# Altium schematic sheet Power.SchDoc
size A4; SheetNumber: 5; SheetTotal: 7
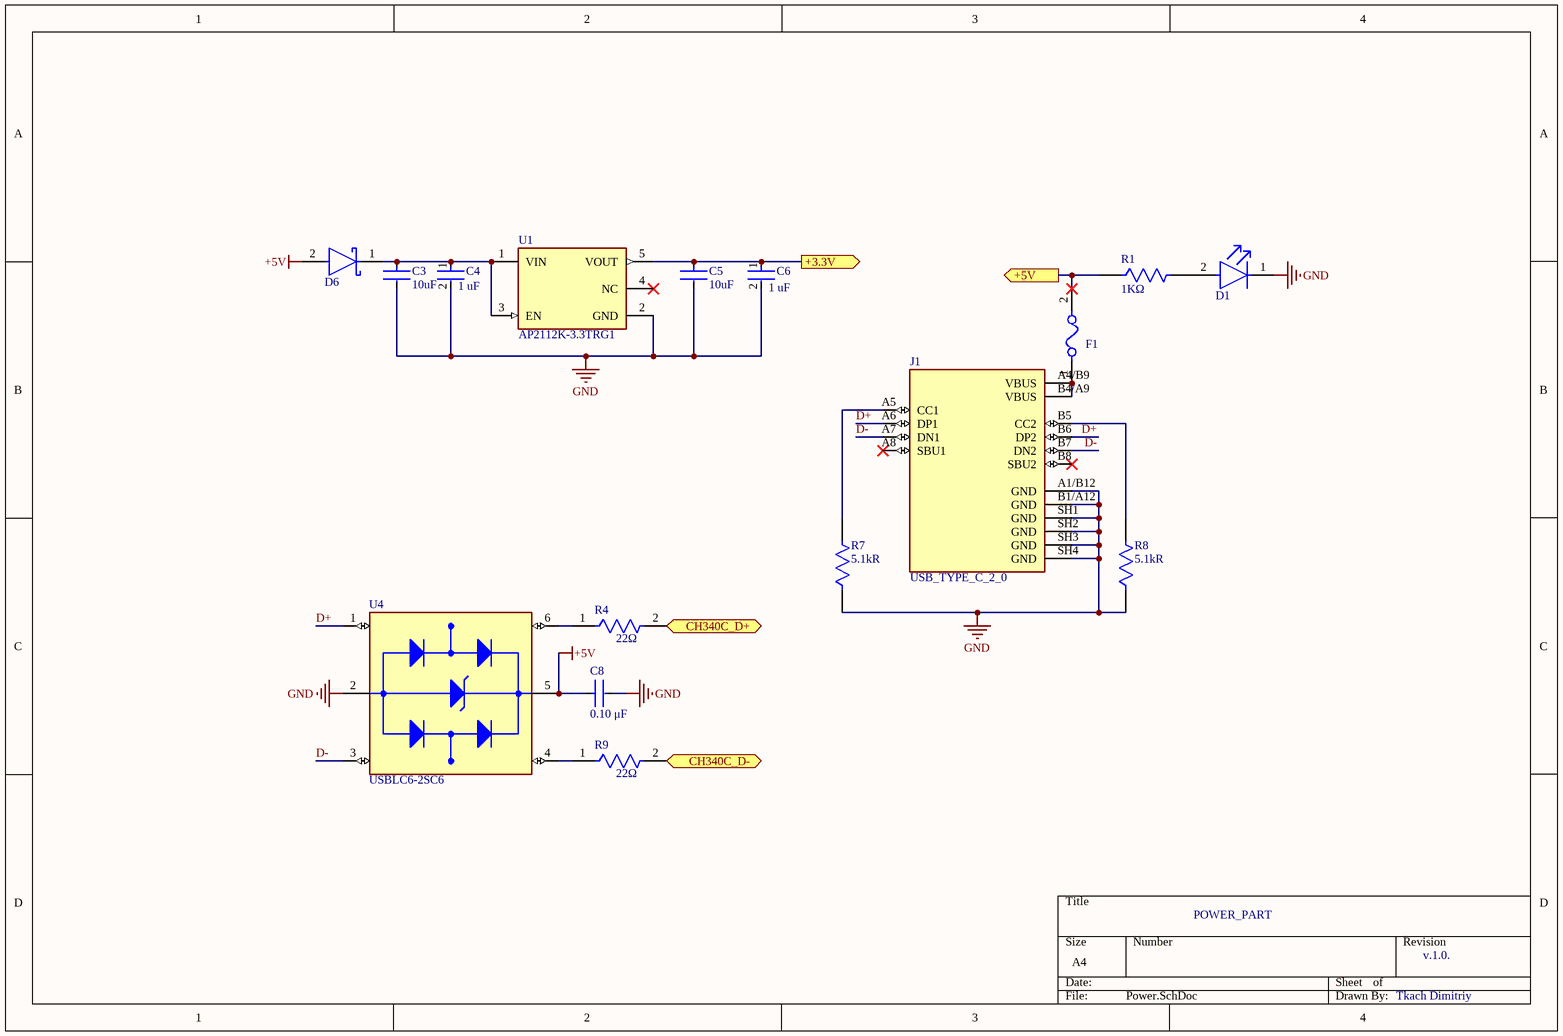
[diagram p0: Power.SchDoc]

## Parts
C3  Capacity: 10uF  [CAPC3216X18M]  (hidden comment: CGA5L1X7R1C106KT0Y0N)
C4  value 1 uF  [CAPC3216X18M]  (hidden comment: CC1206KFX7R7BB105)
C5  Capacity: 10uF  [CAPC3216X18M]  (hidden comment: CGA5L1X7R1C106KT0Y0N)
C6  value 1 uF  [CAPC3216X18M]  (hidden comment: CC1206KFX7R7BB105)
C8  Capacitance: 0.10 μF  [CAPC3216X18M]  (hidden comment: C1206C104K5RACAUTO)
D1  LTST-C150KRKT  [FP-LTST-C150KRKT-MFG]  (value not drawn)
D6  1N5819HW-7-F  [FP-SOD123-MFG]  (value not drawn)
F1  MF-NSMF050-2  [RESC3216X06M]  (value not drawn)
J1  USB_TYPE_C_2_0  [USB Type-C 16Pin]
R1  value 1KΩ  [RESC3216X06M]  (hidden comment: CRGCQ1206F1K0)
R4  Resistance: 22Ω  [RESC3216X06M]  (hidden comment: SR0603FR-7T22RL)
R7  Resistance: 5.1kR  [RESC3216X06M]  (hidden comment: ESR18EZPF5101)
R8  Resistance: 5.1kR  [RESC3216X06M]  (hidden comment: ESR18EZPF5101)
R9  Resistance: 22Ω  [RESC3216X06M]  (hidden comment: SR0603FR-7T22RL)
U1  AP2112K-3.3TRG1  [FP-SOT25-IPC_A]
U4  USBLC6-2SC6  [SOT95P280X145-6N]

## Ports
+3.3V (out, see MainSheet[2B], NTC[3B], STM8S103F3P6[3B], TM1637_Display[1B], UART[2B]), +5V (out, see MainSheet[2B], Relay[2B], TM1637_Display[3B], UART[3B]), CH340C_D+ (bidir, see MainSheet[1B], UART[3B]), CH340C_D- (bidir, see MainSheet[1B], UART[3B])

## Nets
+5V: C8.1 D6.2(A) U4.5(VBUS)
GND: C3.2 C4.2 C5.2 C6.2 C8.2 D1.1(C) J1.A1/B12(GND) J1.B1/A12(GND) J1.SH1(GND) J1.SH2(GND) J1.SH3(GND) J1.SH4(GND) R7.1 R8.1 U1.2(GND) U4.2(GND)
+3.3V: C5.1 C6.1 U1.5(VOUT) ; port +3.3V
+5V: F1.2 R1.1 ; port +5V  [a separate net that carries the same name]
CH340C_D+: R4.2 ; port CH340C_D+
CH340C_D-: R9.2 ; port CH340C_D-
D+: J1.A6(DP1) J1.B6(DP2) U4.1(I/O1_IN)
D-: J1.A7(DN1) J1.B7(DN2) U4.3(I/O2_IN)
NetC3_1: C3.1 C4.1 D6.1(C) U1.1(VIN) U1.3(EN)
NetD1_2: D1.2(A) R1.2
NetF1_1: F1.1 J1.A4/B9(VBUS) J1.B4/A9(VBUS)
NetJ1_A5: J1.A5(CC1) R7.2
NetJ1_B5: J1.B5(CC2) R8.2
NetR4_1: R4.1 U4.6(I/O1_OUT)
NetR9_1: R9.1 U4.4(I/O2_OUT)

Not connected (* = marked no-connect by the designer): J1 A8(SBU1)* B8(SBU2)*; U1 4(NC)*

## Notes on the sheet
- POWER_PART
- v.1.0.
- Tkach Dimitriy

## Library data of the parts
C3 C5 = CMP-08246-001386-1: Cap Ceramic 10uF 16V X7R 10% Pad SMD 1206 +125°C Automotive T/R
C4 C6 = CMP-03422-001151-1: CC1206 1 uF X7R 10.00%16 V; Manufacturer: Yageo; Voltage Rating: 16 V; Automotive Grade: NA; Temperature Coefficient: 15%; Material: Ceramic; Tolerance: 0.1; Category: Cap; Temperature: -55°C to +125°C; Temperature Range Low: -55°C; Capacitance: 1 uF; Package: CC1206-1.25; ComponentLink2Description: Datasheet; RoHS: TRUE; Footprint Url: http://www.yageo.com/exep/pages/download/literatures/UPY-C_GEN_24.pdf; Temperature Characteristic: X7R; ComponentLink2URL: http://www.yageo.com/documents/recent/UPY-NP0X7R_HV_1KV-to-3KV_11.pdf; Height: 1.45mm; Mouser Description: Multilayer Ceramic Capacitors MLCC - SMD/SMT 1.0uF 16V X7R 10%; Lead Free: Yes; Temperature Range High: +125°C; Device Class L1: Passive Components; Octopart: https://octopart.com/cc1206kfx7r7bb105-yageo-22250947; Automotive: No; Device Class L3: Ceramic Capacitors; Device Class L2: Capacitors; Manufacturer Part Number: CC1206KFX7R7BB105
C8 = CMP-03020-005759-1: CAP CER 0.1UF 50V X7R 1206; Manufacturer: KEMET; Temperature Coefficient: 15%; Value: 0.10 μF; Material: Ceramic; Automotive Grade: Grade 0; Tolerance: 0.1; RoHS: TRUE; Lead Free: Yes; ComponentLink2Description: Datasheet; Automotive: Yes; Temperature Characteristic: X7R; Temperature Range Low: -55°C; Voltage Rating: 50 V; Device Class L1: Passive Components; Ipc Land Pattern Name: CAPC320160X78; Mouser Description: Multilayer Ceramic Capacitors MLCC - SMD/SMT 0.1uF 50volts 10% X7R AUTO; Octopart: https://octopart.com/c1206c104k5racauto-kemet-12595586; Device Class L3: Ceramic Capacitors; Manufacturer Part Number: C1206C104K5RACAUTO; Digikey Description: CAP CER 0.1UF 50V X7R 1206; Temperature Range High: +150°C; Temperature: -55°C to +150°C; Device Class L2: Capacitors; ComponentLink2URL: https://content.kemet.com/datasheets/KEM_C1007_X8R_ULTRA_150C_SMD.pdf; Package: C1206C-EB; Category: Cap; Height: 0.88mm
D1 = 8706943c75ba83719d021d2fdc84c58: LED RED CLEAR 1206 SMD; Wavelength: 639nm; Power Dissipation: 62.5mW; Luminous Intensity: 54mcd; Test Current: 20mA; Forward Current: 30mA; Reverse Voltage: 5V; Viewing Angle: 130°; Number of Elements: 1; Lens Style: Diffused; Power Rating: 75mW; Lens Color: Colorless; Forward Voltage: 2V; Dominant Wavelength: 631nm; Depth: 1.6mm; Mount: Surface Mount; Packaging: Tape and Reel; Case Code (Metric): 3216; Lens Transparency: Clear; Illumination Color: Red; Radiation Hardening: No; Min Operating Temperature: -30°C; Height: 1.1mm; Case Code (Imperial): 1206; Number of Pins: 2; Length: 3.2mm; Lead Free: Lead Free; Color: Red; Width: 1.6mm; Number of LEDs: 1; Max Operating Temperature: 85°C; Case/Package: 1206; Package Quantity: 1
D6 = CMP-0303-00003-3: DIODE SCHOTTKY 40V 1A SOD123; Forward Voltage: 450mV; Capacitance: 110pF; Max Forward Surge Current (Ifsm): 25A; Peak Reverse Current: 50uA; Polarity: Standard; Element Configuration: Single; Max Power Dissipation: 450mW; Min Operating Temperature: -65°C; Package Quantity: 3000; Contact Plating: Tin; Weight: 0.000353oz; Max Repetitive Reverse Voltage (Vrrm): 40V; Max Reverse Voltage (DC): 40V; Height: 1.25mm; Average Rectified Current: 1A; Width: 1.7mm; Case/Package: SOD-123-2; Lead Free: Lead Free; Max Operating Temperature: 125°C; Current Rating: 1A; Termination: SMD/SMT; Forward Current: 1A; Radiation Hardening: No; Number of Pins: 2; Length: 2.85mm; Voltage Rating (DC): 40V; REACH SVHC: No SVHC; Peak Non-Repetitive Surge Current: 25A; Packaging: Tape and Reel; Output Current: 1A
F1 = CMP-07400-000036-1: PTC RESET FUSE 13.2V 500MA 1206; Manufacturer: Bourns; Resistance: 0.15-0.7Ω; Hold Current: 0.5A; Trip Current: 1A; Current Rating: 100A; Value: 0.15-0.7Ω; Automotive Grade: Grade 3; Trip Time: 0.1s; Temperature Range Low: -40°C; Temperature: -40°C to +85°C; Digikey Description: PTC RESET FUSE 13.2V 500MA 1206; Ambient Temperature Range Low: -40°C; RoHS: TRUE; Device Class L2: PTC Resettable Fuses; Octopart: https://octopart.com/mf-nsmf050-2-bourns-34532; ComponentLink2Description: Datasheet; Voltage Rating: 13.2V; Category: Fuse; ComponentLink2URL: https://www.bourns.com/docs/product-datasheets/mfnsmf.pdf?sfvrsn=39c76af6_14; Mouser Description: Resettable Fuses - PPTC 0.50A 13.2V 0.15ohm 1206 Footprint; Temperature Range High: +85°C; Device Class L1: Circuit Protection; Device Class L3: unset; Automotive: Yes; Package: MF-NSMF050-2; Ambient Temperature Range High: +85°C; Height: 0.85mm; Manufacturer Part Number: MF-NSMF050-2; Lead Free: Yes
J1 = USB_CMP-002-00072-1: USB-C (USB TYPE-C) USB 2.0 Receptacle Connector 24 (16+8 Dummy) Position Surface Mount, Right Angle; MP: USB4110GFA; MF: Global Connector Technology; Check_prices: https://www.snapeda.com/parts/USB4110GFA/Global+Connector+Technology/view-part/?ref=eda; Design Item ID: USB4110GFA; Source: USB4110GFA.SchLib; Pins: 16; Component Type: Connectors; SnapEDA_Link: https://www.snapeda.com/parts/USB4110GFA/Global+Connector+Technology/view-part/?ref=snap; Value: *; Case/Package: None
R1 = CMP-03211-006592-1: CRGCQ1206 1KΩ 0.25W 1% ±100ppm/°C 200V; Manufacturer: TE Connectivity; Automotive Grade: Grade 685; Tolerance: 0.01; Ipc Land Pattern Name: RESC310155X55; Temperature Range Low: -55°C; Device Class L3: Chip SMD Resistors; ComponentLink2URL: https://www.te.com/commerce/DocumentDelivery/DDEController?Action=showdoc&DocId=Data+Sheet%7F1773204-3%7F1%7Fpdf%7FEnglish%7FENG_DS_1773204-3_1.pdf%7F4-2176347-694; Automotive: Yes; Temperature: -55°C to +155°C; Manufacturer Part Number: CRGCQ1206F1K0; Package: CRGCQ1206; Octopart: https://octopart.com/crgcq1206f1k0-te+connectivity-91018258; Device Class L1: Passive Components; Series: CRGCQ; Device Class L2: Resistors; RoHS: TRUE; Lead Free: Yes; ComponentLink2Description: Datasheet; Power Rating: 0.25W; Temperature Coefficient: ±100ppm/°C; Voltage Rating: 200V; Temperature Range High: +155°C; Height: 0.65mm; Category: Res; Resistance: 1KΩ; Composition: Thick Film; Ambient Temperature Range High: +70°C
R4 R9 = CMP-03412-021889-1: RES 22 OHM 1% 1/4W 0603; Manufacturer: Yageo; Power Rating: 0.25W; Automotive Grade: Grade 0; Tolerance: 0.01; Voltage Rating: 75V; Value: 22Ω; Automotive: Yes; Manufacturer Part Number: SR0603FR-7T22RL; Device Class L1: Passive Components; Temperature Range Low: -55°C; Package: SR0603; Device Class L3: Chip SMD Resistors; Digikey Description: RES 22 OHM 1% 1/4W 0603; RoHS: TRUE; Device Class L2: Resistors; Height: 0.55mm; Ipc Land Pattern Name: RESC16080X45; Temperature Range High: +155°C; Temperature: -55°C to +155°C; Octopart: https://octopart.com/sr0603fr-7t22rl-yageo-91478080; Composition: Thick Film; Category: Res; ComponentLink2URL: http://www.yageo.com/documents/recent/PYu-SR_D_F%20tol_RoHS_L_3.pdf; Lead Free: Yes; Footprint Url: http://www.yageo.com/exep/pages/download/literatures/PYu-R_Mount_10.pdf; ComponentLink2Description: Datasheet; Series: SR
R7 R8 = CMP-08839-028234-1: 5.1kΩ ±1% 0.5W 1206 Anti-Surge Chip Resistor AEC-Q200; Temperature Coefficient: 100ppm/°C; Max Power Dissipation: 333mW; Resistor Type: Thick Film; Max Operating Temperature: 155°C; Min Operating Temperature: -55°C; Features: Automotive AEC-Q200; Height: 0.026inch; Length: 0.126inch; Packaging: Tape and Reel; Width: 0.063inch; Case/Package: 1206; Tolerance: 1%; Series: ESR18; Number of Terminations: 2; RoHS Compliant: Yes; Package Quantity: 5000
U1 = CMP-12756-000035-1: IC REG LINEAR 3.3V 600MA SOT25; Number of Regulators: 1; Output Type: Fixed; Polarity: Positive; Min Input Voltage: 2.5V; Max Input Voltage: 6V; Accuracy: 1.5%; Quiescent Current: 55uA; Dropout Voltage: 250mV; Min Operating Temperature: -40°C; Length: 3.1mm; Output Current: 600mA; Max Operating Temperature: 85°C; Package Quantity: 1; Output Voltage: 3.3V; Width: 1.7mm; Number of Outputs: 1; Packaging: Tape and Reel; Height: 1.3mm; Lead Free: Lead Free; Max Output Current: 600mA; Case/Package: SOT-23-5; Mount: Surface Mount; Number of Pins: 5
U4 = USBLC6-2SC6: 17V Clamp 5A (8/20Âµs) Ipp Tvs Diode Surface Mount SOT-23-6; MF: STMicroelectronics; Value: *; SnapEDA_Link: https://www.snapeda.com/parts/USBLC6-2SC6/STMicroelectronics/view-part/?ref=snap; Check_prices: https://www.snapeda.com/parts/USBLC6-2SC6/STMicroelectronics/view-part/?ref=eda; Purchase-URL: https://pricing.snapeda.com/search/part/USBLC6-2SC6/?ref=eda; Price: None; Availability: In Stock; Package: SOT-23-6 STMicroelectronics; MP: USBLC6-2SC6